# EasyEDA schematic Artefato2Esquema.json
TITLE: Sheet_1; REV: 1.0; Date: 2024-10-13; Sheet: 1/1; Drawn By: hudson.gva2; Company: Your Company
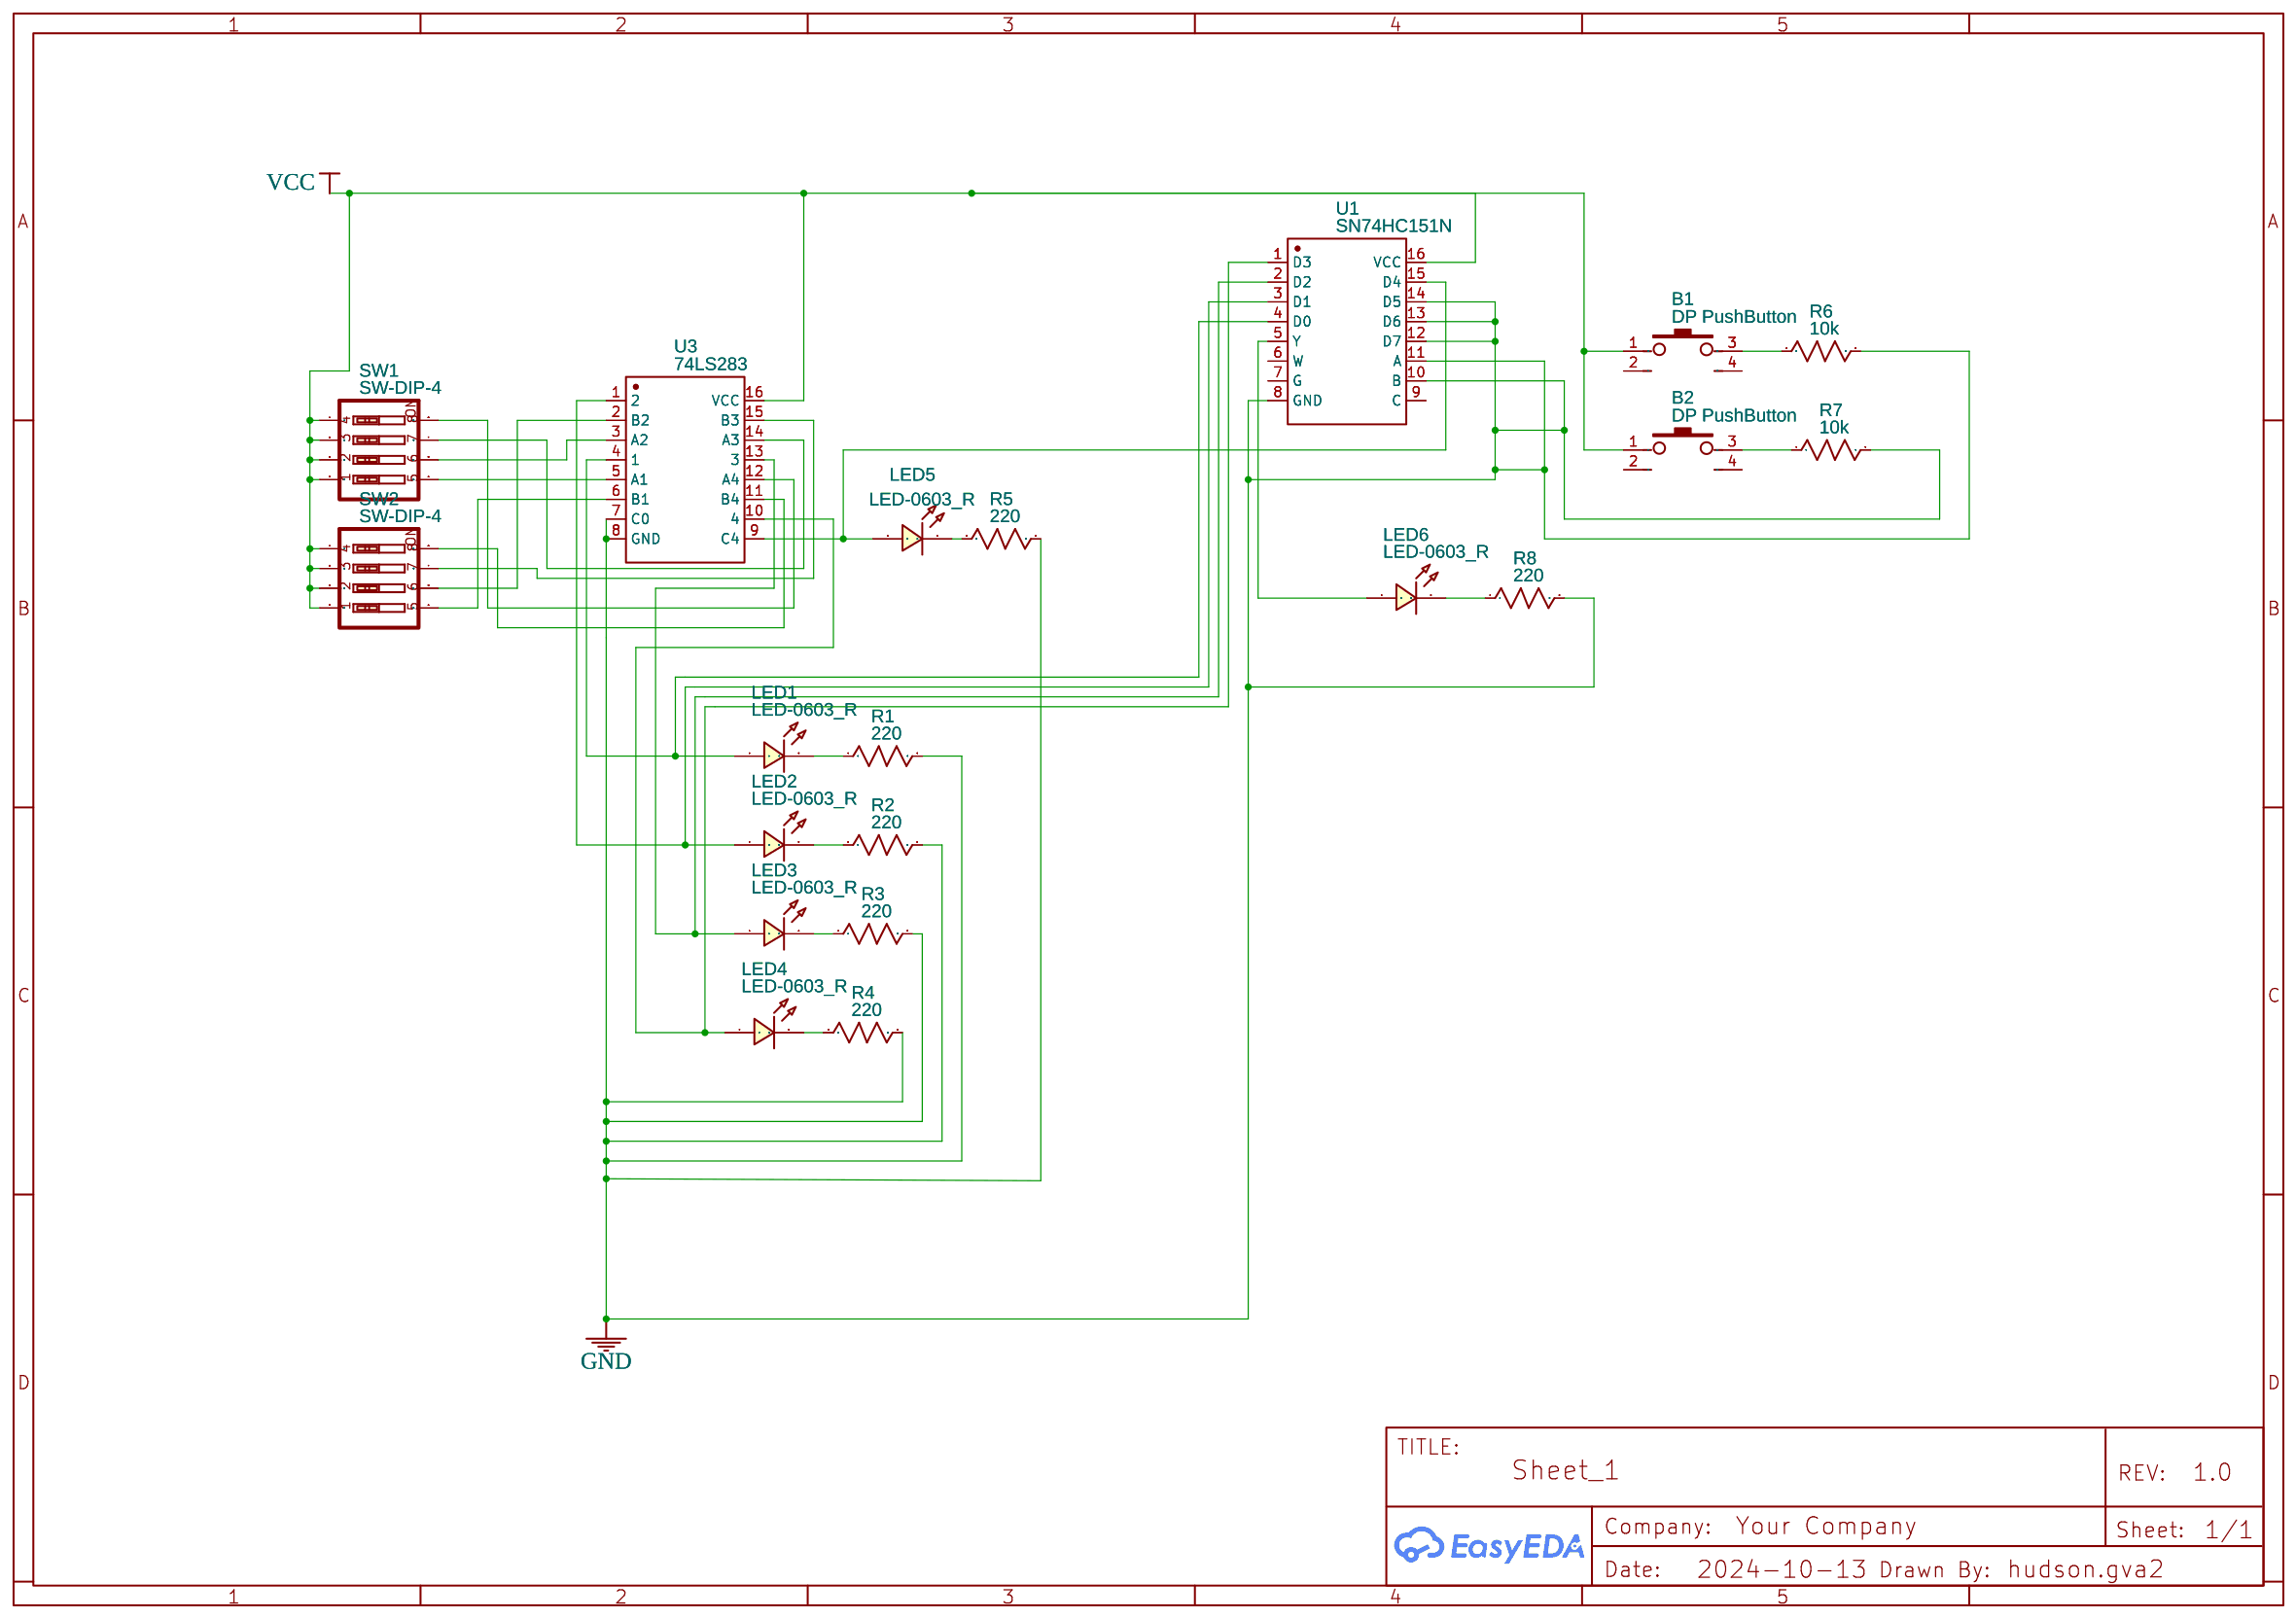
[diagram p0: schematic sheet]

## Parts
B1  DP PushButton  [PUSHBUTTON]
B2  DP PushButton  [PUSHBUTTON]
LED1  LED-0603_R  [LED0603_RED]
LED2  LED-0603_R  [LED0603_RED]
LED3  LED-0603_R  [LED0603_RED]
LED4  LED-0603_R  [LED0603_RED]
LED5  LED-0603_R  [LED0603_RED]
LED6  LED-0603_R  [LED0603_RED]
R1  220  [R0603]
R2  220  [R0603]
R3  220  [R0603]
R4  220  [R0603]
R5  220  [R0603]
R6  10k  [R0603]
R7  10k  [R0603]
R8  220  [R0603]
SW1  SW-DIP-4  [DIPSWITCH-08]
SW2  SW-DIP-4  [DIPSWITCH-08]
U1  SN74HC151N  [DIP16]
U3  74LS283  [74LS283]

## Library data of the parts
B1 B2 = DP PushButton: Manufacturer Part: New SchematicLib; Contributor: eminence_x
LED1-LED6 = LED-0603_R: Manufacturer: EVERLIGHT(台湾亿光); Manufacturer Part: 19-217/R6C-AL1M2VY/3T; Supplier Part: C72044; Supplier: LCSC; Contributor: LCEDA_01
R1-R8 = R_0603_US: Contributor: LCEDA_Lib
SW1 SW2 = SW-DIP-4: DIP Switch 8 Position; Contributor: Ric_; sourceId: 4SM4YgyPJ
U1 = SN74HC151N
U3 = 74LS283: Supplier: LCSC; Supplier Part: C2871513; Manufacturer: TI(德州仪器); Manufacturer Part: SN74LS283D; Contributor: TomPilot

## Nets
GND: R1.2 R2.2 R3.2 R4.2 R5.2 R6.2 R7.2 R8.2 U1.8(GND) U1.10(B) U1.11(A) U1.12(D7) U1.13(D6) U1.14(D5) U3.7(C0) U3.8(GND)
VCC: B1.1 B2.1 SW1.1 SW1.2 SW1.3 SW1.4 SW2.1 SW2.2 SW2.3 SW2.4 U1.16(VCC) U3.16(VCC)
Net-(B1-3): B1.3 R6.1
Net-(B2-3): B2.3 R7.1
Net-(LED1-1): LED1.1 U1.4(D0) U3.4(1)
Net-(LED1-2): LED1.2 R1.1
Net-(LED2-1): LED2.1 U1.3(D1) U3.1(2)
Net-(LED2-2): LED2.2 R2.1
Net-(LED3-1): LED3.1 U1.2(D2) U3.13(3)
Net-(LED3-2): LED3.2 R3.1
Net-(LED4-1): LED4.1 U1.1(D3) U3.10(4)
Net-(LED4-2): LED4.2 R4.1
Net-(LED5-1): LED5.1 U1.15(D4) U3.9(C4)
Net-(LED5-2): LED5.2 R5.1
Net-(LED6-1): LED6.1 U1.5(Y)
Net-(LED6-2): LED6.2 R8.1
Net-(SW1-5): SW1.5(13) U3.5(A1)
Net-(SW1-6): SW1.6(14) U3.3(A2)
Net-(SW1-7): SW1.7(15) U3.14(A3)
Net-(SW1-8): SW1.8(16) U3.12(A4)
Net-(SW2-5): SW2.5(13) U3.6(B1)
Net-(SW2-6): SW2.6(14) U3.2(B2)
Net-(SW2-7): SW2.7(15) U3.15(B3)
Net-(SW2-8): SW2.8(16) U3.11(B4)

Not connected (* = marked no-connect by the designer): B1 2(1) 4(2); B2 2(1) 4(2); U1 6(W) 7(G) 9(C)
